# EAGLE schematic ts9dx_redraw (EAGLE 9.6.0)
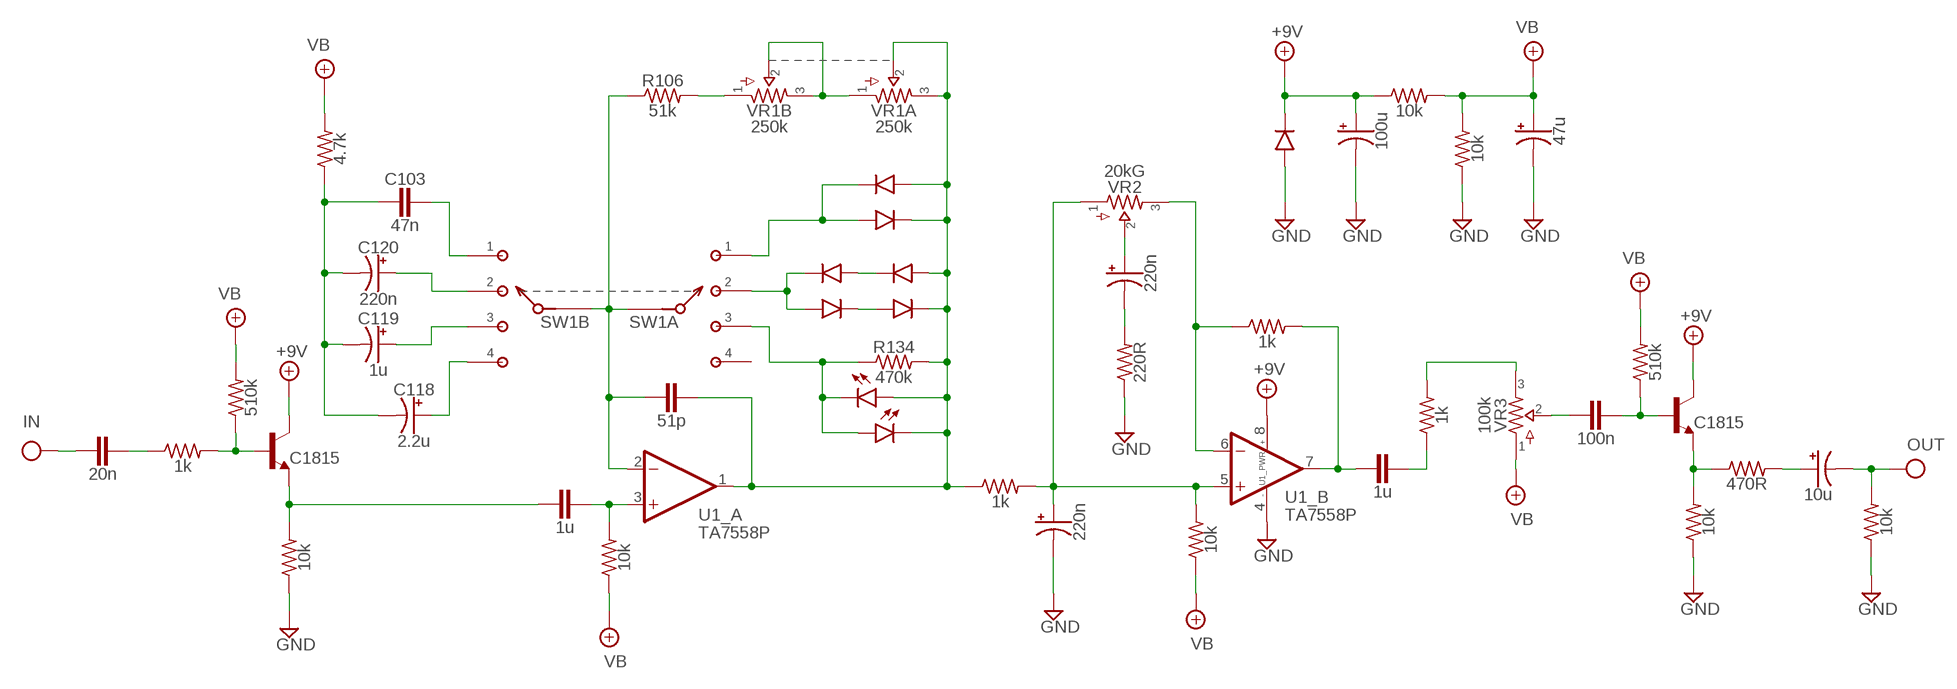
[diagram p0: schematic, sheet 1]

## Parts
C1  51p  CER/FILMBOX.1  [BOX_SMALL]
C101  20n  CER/FILMBOX.1  [BOX_SMALL]
C102  1u  CER/FILMBOX.1  [BOX_SMALL]
C103  47n  CER/FILMBOX.1  [BOX_SMALL]
C105  220n  0500  [050_020]
C106  220n  0500  [050_020]
C107  1u  CER/FILMBOX.1  [BOX_SMALL]
C108  100n  CER/FILMBOX.1  [BOX_SMALL]
C109  10u  0500  [050_020]
C116  47u  0500  [050_020]
C117  100u  0500  [050_020]
C118  2.2u  0500  [050_020]
C119  1u  0500  [050_020]
C120  220n  0500  [050_020]
D1  DO35.2  [DO35-2]
D2  DO35.2  [DO35-2]
D3  DO35.2  [DO35-2]
D4  DO35.2  [DO35-2]
D5  LED  [3MM_D]
D6  LED  [3MM_D]
D7  DO35.2  [DO35-2]
D8  DO35.2  [DO35-2]
D108  DO35.2  [DO35-2]
Q101  C1815  2N3904  [TO92-]
Q103  C1815  2N3904  [TO92-]
R3  4.7k  R_.3B  [R0207/3]
R101  1k  R_.3B  [R0207/3]
R102  510k  R_.3B  [R0207/3]
R103  10k  R_.3B  [R0207/3]
R105  10k  R_.3B  [R0207/3]
R106  51k  R_.3B  [R0207/3]
R107  1k  R_.3B  [R0207/3]
R108  220R  R_.3B  [R0207/3]
R109  10k  R_.3B  [R0207/3]
R110  1k  R_.3B  [R0207/3]
R111  1k  R_.3B  [R0207/3]
R112  510k  R_.3B  [R0207/3]
R113  10k  R_.3B  [R0207/3]
R114  470R  R_.3B  [R0207/3]
R115  10k  R_.3B  [R0207/3]
R132  10k  R_.3B  [R0207/3]
R133  10k  R_.3B  [R0207/3]
R134  470k  R_.3B  [R0207/3]
SW1  2P4T  [SMALLROTARY]
U1  TA7558P  DUALTH  [DIL0]
VR1A  250k  POTS16MM  [16MM]
VR1B  250k  POTS16MM  [16MM]
VR2  20kG  POTS16MM  [16MM]
VR3  100k  POTS16MM  [16MM]

## Nets
+9V: C117.+ D108.C Q101.1(C) Q103.1(C) R133.1 U1.8(_PWR:V+)
GND: C105.- C116.- C117.- D108.A R103.1 R108.1 R113.1 R115.1 R132.1 U1.4(_PWR:V-)
IN: C101.2
N$1: D1.A D4.C SW1.2
N$2: C107.1 R111.1
N$3: Q101.2(B) R101.2 R102.1
N$4: C102.2 Q101.3(E) R103.2
N$5: C102.1 R105.2 U1.3(_A:+IN)
N$6: D1.C D2.A
N$7: R111.2 VR3.3
N$8: R106.2 VR1B.1
N$9: D3.C D4.A
N$10: C105.+ R107.2 R109.2 U1.5(_B:+IN) VR2.1
N$11: R110.1 U1.6(_B:-IN) VR2.3
N$12: C107.2 R110.2 U1.7(_B:OUT)
N$13: C1.2 R106.1 SW1.9(B:A) SW1.C(A:A) U1.2(_A:-IN)
N$14: C106.+ VR2.2
N$15: C106.- R108.2
N$16: D7.A D8.C SW1.1
N$17: C1.1 D2.C D3.A D5.ANODE(A) D6.P$1(C) D7.C D8.A R107.1 R134.2 U1.1(_A:OUT) VR1A.2 VR1A.3
N$18: D5.P$1(C) D6.ANODE(A) R134.1 SW1.3
N$19: VR1A.1 VR1B.2 VR1B.3
N$20: C108.2 VR3.2
N$21: C119.+ SW1.7
N$22: C118.+ SW1.8
N$23: C108.1 Q103.2(B) R112.1
N$24: Q103.3(E) R113.2 R114.1
N$25: C109.+ R114.2
N$26: C120.+ SW1.6
N$27: C103.2 C118.- C119.- C120.- R3.1
N$28: C103.1 SW1.5
N$33: C101.1 R101.1
OUT: C109.- R115.2
VB: C116.+ R3.2 R102.2 R105.1 R109.1 R112.2 R132.2 R133.2 VR3.1
Unconnected: SW1.4

## Library data of the parts
C1 C101-C103 C107 C108 = pedals-capacitors-film:CER/FILM: 47 - 120pF Xicon Ceramic Disc 2.5mm lead spacing
C105 C106 C109 C116-C120 = pedals-capacitors-elec:050
D1-D4 D7 D8 D108 = pedals-diodes:DO35: DO-35 Package Diodes: 1N914
D5 D6 = pedals-diodes:LED
Q101 Q103 = pedals-transistors:2N3904: NPN Transistor
R3 R101-R103 R105-R115 R132-R134 = pedals-resistors:R_
SW1 = pedals-switches:2P4T
U1 = pedals-integrated circuits:DUAL: OP AMP
VR1A VR1B VR2 VR3 = pedals-potentiometers:POTS